# Altium schematic sheet Sheet1.SchDoc
size A4
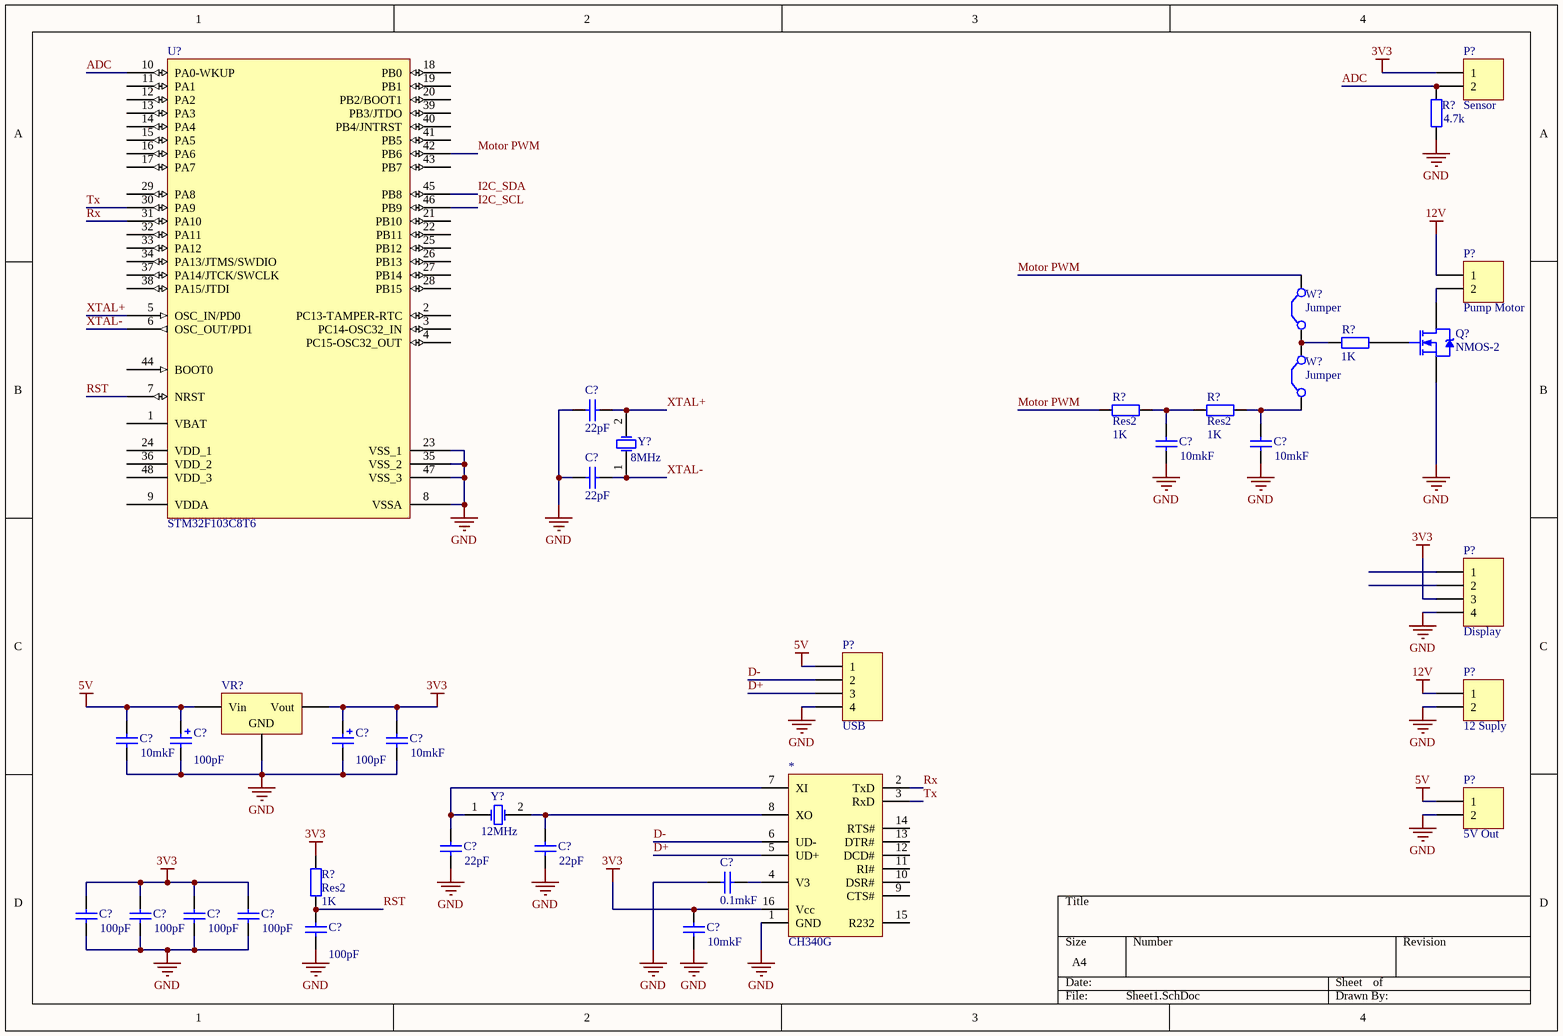
[diagram p0: Sheet1.SchDoc]

## Parts
(Parts that share a designator on the sheet are numbered #1, #2 ... from top to bottom, then left to right.)
*  CH340G
C?#1  value 22pF  [C1206]  (hidden comment: Cap Semi)
C?#2  value 10mkF  [C1206]  (hidden comment: Cap Semi)
C?#3  value 10mkF  [C1206]  (hidden comment: Cap Semi)
C?#4  value 22pF  [C1206]  (hidden comment: Cap Semi)
C?#5  value 100pF  [POLAR0.8]  (hidden comment: Cap Pol2)
C?#6  value 100pF  [POLAR0.8]  (hidden comment: Cap Pol2)
C?#7  value 10mkF  [C1206]  (hidden comment: Cap Semi)
C?#8  value 10mkF  [C1206]  (hidden comment: Cap Semi)
C?#9  value 22pF  [C1206]  (hidden comment: Cap Semi)
C?#10  value 22pF  [C1206]  (hidden comment: Cap Semi)
C?#11  value 0.1mkF  [C1206]  (hidden comment: Cap Semi)
C?#12  value 100pF  [C1206]  (hidden comment: Cap Semi)
C?#13  value 100pF  [C1206]  (hidden comment: Cap Semi)
C?#14  value 100pF  [C1206]  (hidden comment: Cap Semi)
C?#15  value 100pF  [C1206]  (hidden comment: Cap Semi)
C?#16  value 100pF  [C1206]  (hidden comment: Cap Semi)
C?#17  value 10mkF  [C1206]  (hidden comment: Cap Semi)
P?#1  Sensor  [HDR1X2]
P?#2  Pump Motor  [HDR1X2]
P?#3  Display  [HDR1X4]
P?#4  USB  [HDR1X4]
P?#5  12 Suply  [HDR1X2]
P?#6  5V Out  [HDR1X2]
Q?  NMOS-2  [TO-220AB]
R?#1  value 4.7k  [AXIAL-0.4]  (hidden comment: Res2)
R?#2  value 1K  [AXIAL-0.4]  (hidden comment: Res2)
R?#3  Res2  value 1K  [AXIAL-0.4]
R?#4  Res2  value 1K  [AXIAL-0.4]
R?#5  Res2  value 1K  [AXIAL-0.4]
U?  STM32F103C8T6  [LQFP48_N]
VR?  Volt Reg  [D2PAK_N]  (value not drawn)
W?#1  Jumper  [RAD-0.2]
W?#2  Jumper  [RAD-0.2]
Y?#1  value 8MHz  [R38]  (hidden comment: XTAL)
Y?#2  value 12MHz  [R38]  (hidden comment: XTAL)

## Nets
3V3: *.16(Vcc) C?#6.1 C?#8.2 C?#12.2 C?#13.2 C?#14.2 C?#15.2 C?#17.2 P?#1.1 P?#3.3 R?#5.2 VR?.3(Vout)
5V: C?#5.1 C?#7.2 P?#4.1 P?#6.1 VR?.1(Vin)
12V: P?#2.1 P?#5.1
GND: *.1(GND) C?#1.2 C?#2.1 C?#3.1 C?#4.2 C?#5.2 C?#6.2 C?#7.1 C?#8.1 C?#9.1 C?#10.1 C?#11.2 C?#12.1 C?#13.1 C?#14.1 C?#15.1 C?#16.1 C?#17.1 P?#3.4 P?#4.4 P?#5.2 P?#6.2 Q?.3(S) R?#1.1 U?.8(VSSA) U?.23(VSS_1) U?.35(VSS_2) U?.47(VSS_3) VR?.2(GND)
ADC: P?#1.2 R?#1.2 U?.10(PA0-WKUP)
D+: *.5(UD+) P?#4.3
D-: *.6(UD-) P?#4.2
I2C_SCL: U?.46(PB9)
I2C_SDA: U?.45(PB8)
Motor PWM: R?#3.1 U?.42(PB6) W?#1.2(C2)
RST: C?#16.2 R?#5.1 U?.7(NRST)
Rx: *.2(TxD) U?.31(PA10)
Tx: *.3(RxD) U?.30(PA9)
XTAL+: C?#1.1 U?.5(OSC_IN/PD0) Y?#1.2(OSC2)
XTAL-: C?#4.1 U?.6(OSC_OUT/PD1) Y?#1.1(OSC1)
Net*_4: *.4(V3) C?#11.1
Net*_7: *.7(XI) C?#9.2 Y?#2.1(OSC1)
Net*_8: *.8(XO) C?#10.2 Y?#2.2(OSC2)
NetC?#2_2: C?#2.2 R?#3.2 R?#4.1
NetC?#3_2: C?#3.2 R?#4.2 W?#2.1(C1)
NetP?#2_2: P?#2.2 Q?.2(D)
NetQ?_1: Q?.1(G) R?#2.2
NetR?#2_1: R?#2.1 W?#1.1(C1) W?#2.2(C2)

Not connected (* = marked no-connect by the designer): * 9(CTS#) 10(DSR#) 11(RI#) 12(DCD#) 13(DTR#) 14(RTS#) 15(R232); P?#3 1 2; U? 1(VBAT) 2(PC13-TAMPER-RTC) 3(PC14-OSC32_IN) 4(PC15-OSC32_OUT) 9(VDDA) 11(PA1) 12(PA2) 13(PA3) 14(PA4) 15(PA5) 16(PA6) 17(PA7) 18(PB0) 19(PB1) 20(PB2/BOOT1) 21(PB10) 22(PB11) 24(VDD_1) 25(PB12) 26(PB13) 27(PB14) 28(PB15) 29(PA8) 32(PA11) 33(PA12) 34(PA13/JTMS/SWDIO) 36(VDD_2) 37(PA14/JTCK/SWCLK) 38(PA15/JTDI) 39(PB3/JTDO) 40(PB4/JNTRST) 41(PB5) 43(PB7) 44(BOOT0) 48(VDD_3)

## Library data of the parts
C?#1-C?#4 C?#7-C?#17 = Cap Semi: Capacitor (Semiconductor SIM Model); Published: 8-Jun-2000; LatestRevisionDate: 29-May-2009; LatestRevisionNote: IPC-7351 Footprint Added.; PackageReference: C1206; Publisher: Altium Limited; PackageDescription: Chip Capacitor
C?#5 C?#6 = Cap Pol2: Polarized Capacitor (Axial); Published: 8-Jun-2000; LatestRevisionDate: 17-Jul-2002; LatestRevisionNote: Re-released for DXP Platform.; PackageReference: POLAR0.8; Publisher: Altium Limited; PackageDescription: Polarized Capacitor; 2 Leads
P?#1 P?#2 P?#5 P?#6 = Header 2: Header, 2-Pin; LatestRevisionDate: 17-Jul-2002; LatestRevisionNote: Re-released for DXP Platform.; Publisher: Altium Limited
P?#3 P?#4 = Header 4: Header, 4-Pin; LatestRevisionDate: 17-Jul-2002; LatestRevisionNote: Re-released for DXP Platform.; Publisher: Altium Limited
Q? = NMOS-2: N-Channel Power MOSFET; Note: Pin 2 is electrically connected to pin 4.; Published: 8-Jun-2000; LatestRevisionDate: 17-Jul-2002; LatestRevisionNote: Re-released for DXP Platform.; DatasheetVersion: PD-9.814; PackageVersion: Feb-1997; PackageReference: TO-220AB; Publisher: Altium Limited; PackageDescription: TO, Thru-Hole, Vertical, Heatsink Mounted; 3 In-Line Leads; Pitch 2.54 mm; ComponentLink1Description: Manufacturer Link; ComponentLink1URL: http://www.irf.com/
R?#1-R?#5 = Res2: Resistor; Published: 8-Jun-2000; LatestRevisionDate: 17-Jul-2002; LatestRevisionNote: Re-released for DXP Platform.; PackageReference: AXIAL-0.4; Publisher: Altium Limited; PackageDescription: Axial Device, Thru-Hole; 2 Leads; 0.4 in Pin Spacing
U? = STM32F103C8T6: STM32 ARM-based 32-bit MCU with 64 Kbytes Flash, 48-pin LQFP, Industrial Temperature; Published: 30-May-2008; DatasheetVersion: rev6, Mar-2008; PackageVersion: Mar-2008; PackageReference: LQFP48; Publisher: Altium Limited; PackageDescription: 48-Pin Low-Profile Quad Flat Pack, 7 x 7 mm Body, 0.5 mm Pitch (LQFP48); ComponentLink1Description: Manufacturer Link; ComponentLink1URL: www.st.com/stm32; ComponentLink2Description: Datasheet; ComponentLink2URL: http://www.st.com/stonline/products/literature/ds/13587.pdf
VR? = Volt Reg: Voltage Regulator; Published: 24-Mar-1999; LatestRevisionDate: 29-May-2009; LatestRevisionNote: IPC-7351 Footprint Added.; PackageReference: D2PAK; Publisher: Altium Limited; PackageDescription: 3-Pin Transistor Outline Package 2.54 mm Pitch, 15.1 mm Lead Span
W?#1 W?#2 = Jumper: Jumper Wire; Published: 24-Mar-1999; LatestRevisionDate: 17-Jul-2002; LatestRevisionNote: Re-released for DXP Platform.; PackageReference: RAD-0.2; Publisher: Altium Limited; PackageDescription: Radial Cap, Thru-Hole; 2 Leads; 0.2 in Pin Spacing
Y?#1 Y?#2 = XTAL: Crystal Oscillator; Published: 8-Jun-2000; LatestRevisionDate: 17-Jul-2002; LatestRevisionNote: Re-released for DXP Platform.; PackageReference: R38; Publisher: Altium Limited; PackageDescription: Crystal, Thru-Hole; 2 Leads; Body 3.1 x 8.2 mm (Dia.xH)